# EAGLE design RTx_Charger (EAGLE 6.5.0)
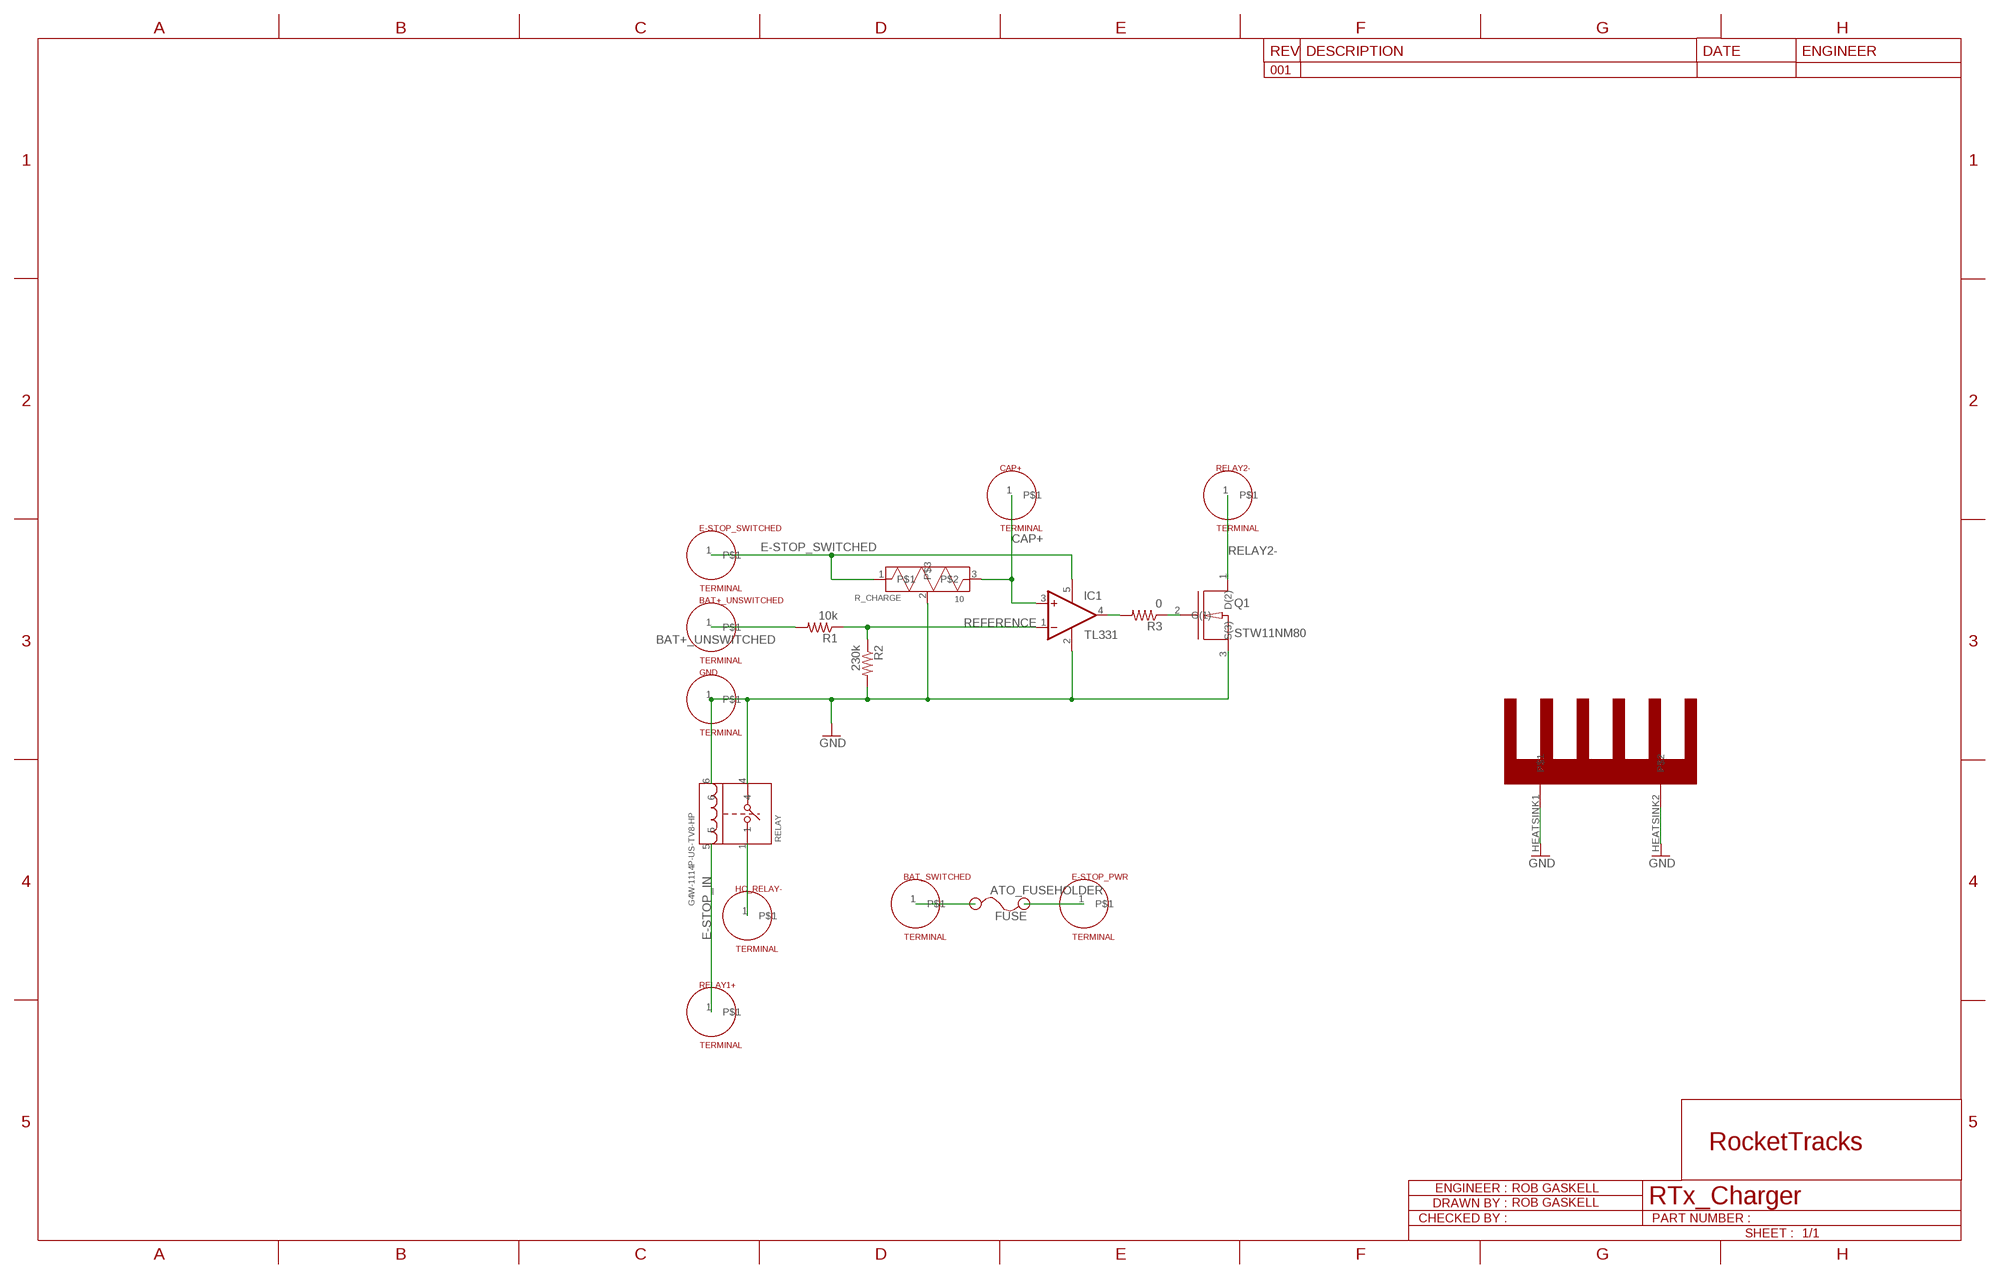
[diagram p0: schematic, sheet 1]

## Parts
BAT+_UNSWITCHED  TERMINAL  TERMINALSTUD  [TERMINAL_STUD]
BAT_SWITCHED  TERMINAL  TERMINALNO_STUD  [TERMINAL_NO-STUD]
CAP+  TERMINAL  TERMINALSTUD  [TERMINAL_STUD]
E-STOP_PWR  TERMINAL  TERMINALSTUD  [TERMINAL_STUD]
E-STOP_SWITCHED  TERMINAL  TERMINALNO_STUD  [TERMINAL_NO-STUD]
FUSE  ATO_FUSEHOLDER  FUSEATO_FUSEHOLDER  [ATO_BLADE_FUSE]
GND  TERMINAL  TERMINALSTUD  [TERMINAL_STUD]
HC_RELAY-  TERMINAL  TERMINALNO_STUD  [TERMINAL_NO-STUD]
HEATSINK  WA-T247-101E  [WA-T247-101E]
IC1  TL331  [DBV-R-PDSO-G5]
Q1  STW11NM80  [TO-247]
R1  10k  R-US_R1206  [R1206]
R2  230k  R-US_R1206  [R1206]
R3  0  R-US_R1206  [R1206]
R_CHARGE  10  TEH70  [TEH70]
RELAY  G4W-1114P-US-TV8-HP  [G4W-1114P-US-TV8-HP]
RELAY1+  TERMINAL  TERMINALNO_STUD  [TERMINAL_NO-STUD]
RELAY2-  TERMINAL  TERMINALNO_STUD  [TERMINAL_NO-STUD]

## Nets
BAT+_UNSWITCHED: BAT+_UNSWITCHED.1 R1.2
BAT_SWITCHED: BAT_SWITCHED.1 FUSE.2.1(C) FUSE.2.2(C) FUSE.2.3(C) FUSE.2.4(C)
CAP+: CAP+.1 IC1.3(+IN) R_CHARGE.3
E-STOP_IN: RELAY1+.1 RELAY.5
E-STOP_PWR: E-STOP_PWR.1 FUSE.1.1(A) FUSE.1.2(A) FUSE.1.3(A) FUSE.1.4(A)
E-STOP_SWITCHED: E-STOP_SWITCHED.1 IC1.5(V+) R_CHARGE.1
GND: GND.1 HEATSINK.HEATSINK1 HEATSINK.HEATSINK2 IC1.2(GND) Q1.3(S(3)) R2.2 R_CHARGE.2 RELAY.4 RELAY.6
HC_RELAY-: HC_RELAY-.1 RELAY.1
N$1: IC1.4(OUT) R3.2
N$5: Q1.2(G(1)) R3.1
REFERENCE: IC1.1(-IN) R1.1 R2.1
RELAY2-: Q1.1(D(2)) RELAY2-.1

## Library data of the parts
BAT+_UNSWITCHED BAT_SWITCHED CAP+ E-STOP_PWR E-STOP_SWITCHED GND HC_RELAY- RELAY1+ RELAY2- = temp_library:TERMINAL
FUSE = temp_library:FUSE: FUSE
HEATSINK = temp_library:WA-T247-101E
IC1 = linear:TL331: SINGLE DIFFERENTIAL COMPARATOR Source: Data sheet <http://www.ti.com/lit/ds/symlink/tl331-q1.pdf>
Q1 = temp_library:STW11NM80: N-Channel MOSFET transistor
R1-R3 = motorFeedback:R-US_: RESISTOR, American symbol
R_CHARGE = temp_library:TEH70
RELAY = temp_library:G4W-1114P-US-TV8-HP

## Board
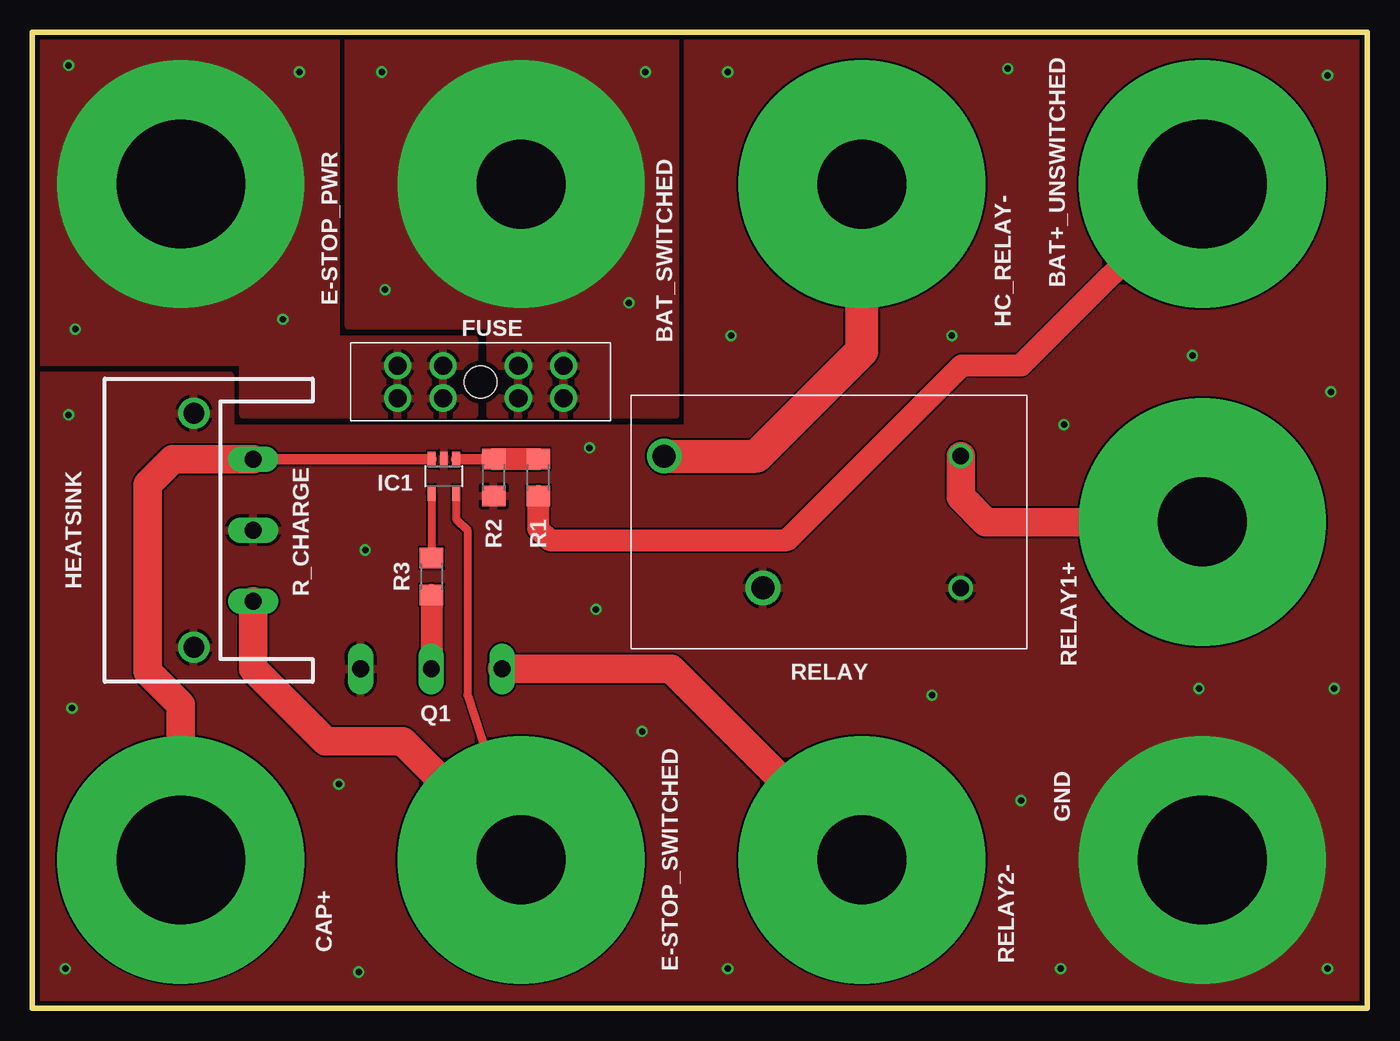
[diagram p1: board, top side]
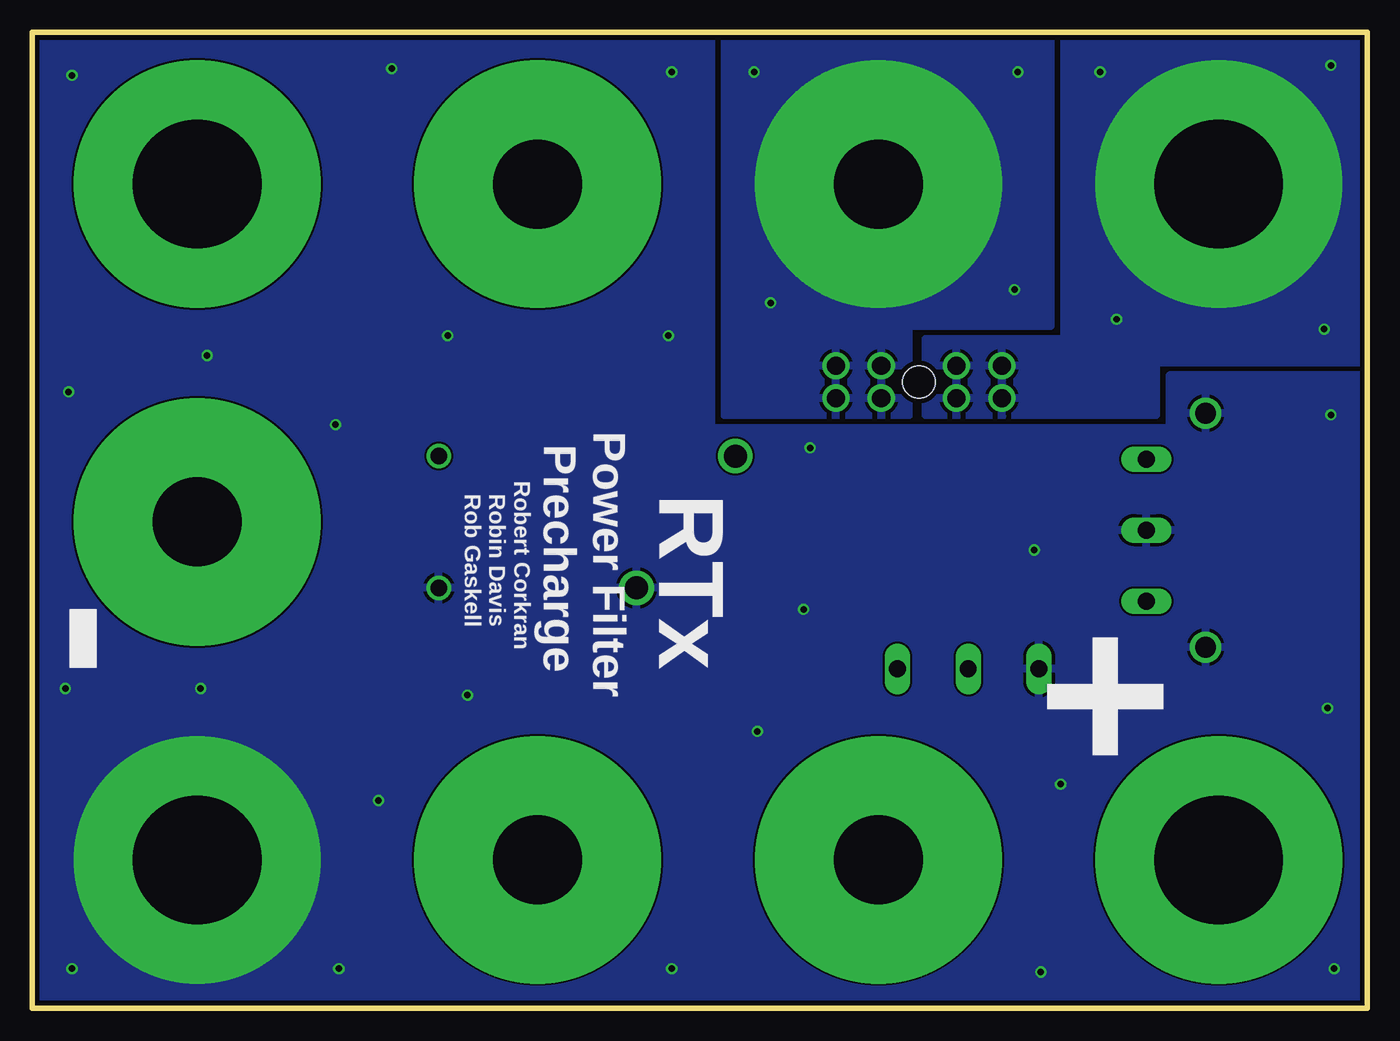
[diagram p2: board, bottom side, seen from below]

Size 102.87 x 75.18 mm. Coordinates in mm from the lower left corner, seen from the top.
Outline: 0,0 102.87,0 102.87,75.18 0,75.18 0,0
Copper layers (1*16): Top 0.0356mm / dielectric 1.5011mm / Bottom 0.0356mm
Design rules "osh-park-2layer *": minimum track width 6mil, minimum drill 13mil, track to track 6mil, track to pad 6mil, pad to pad 6mil, via to via 6mil, smd to smd 6mil, copper to edge 15mil, drill to drill 6mil, minimum pad ring 7mil, minimum via ring 7mil, stop-mask expansion 3mil, vias tented up to drill 30mil, thermal gap 10mil

### Footprints (pad centres in the part's own frame; a part is rotated, then mirrored left to right if it is on the bottom)
TERMINAL_STUD = drill 9.906 pad 19.05: 1 0,0
TERMINAL_NO-STUD = drill 6.858 pad 19.05: 1 0,0
ATO_BLADE_FUSE = drill 1.4: 1.1 -6.4,1.25; 1.2 -6.4,-1.25; 1.3 -2.9,1.25; 1.4 -2.9,-1.25; 2.1 2.9,1.25; 2.2 2.9,-1.25; 2.3 6.4,1.25; 2.4 6.4,-1.25 | hole 2.5: 0,0
WA-T247-101E = drill 1.6: HEATSINK1 -9.017,0; HEATSINK2 9.017,0
DBV-R-PDSO-G5 = smd 0.6 x 1.2: 1 -0.95,-1.306; 2 0,-1.306; 3 0.95,-1.306; 4 0.95,1.306; 5 -0.95,1.306
TO-247 = drill 1.3 long: 1 -5.461,0; 2 0,0; 3 5.461,0
R1206 = smd 1.6 x 1.803: 1 -1.422,0; 2 1.422,0
TEH70 = drill 1.3 long: 1 -5.461,-4.572; 2 0,-4.572; 3 5.461,-4.572
G4W-1114P-US-TV8-HP = drill 1.778: 1 15.24,-5.08; 4 7.62,5.08 | drill 1.27: 5 -7.62,-5.08; 6 -7.62,5.08

### Placement (x,y rotation side)
BAT+_UNSWITCHED  90.17,63.5 0 top
BAT_SWITCHED  37.67,63.5 0 top
CAP+  11.43,11.43 0 top
E-STOP_PWR  11.43,63.5 0 top
E-STOP_SWITCHED  37.67,11.43 0 top
FUSE  34.54,48.26 0 top
GND  90.17,11.43 0 top
HC_RELAY-  63.93,63.5 0 top
HEATSINK  12.45,36.83 90 top
IC1  31.71,40.99 180 top
Q1  30.75,26.14 180 top
R1  38.99,40.89 270 top
R2  35.56,40.89 270 top
R3  30.75,33.27 90 top
R_CHARGE  12.45,36.83 90 top
RELAY  63.93,37.47 180 top
RELAY1+  90.17,37.47 0 top
RELAY2-  63.93,11.43 0 top

### Tracks (layer width: path | path; a pad name or v marks a point on that pad's centre or on a via)
BAT+_UNSWITCHED
  Top 1.676: R1.2 38.99,36.96 39.88,36.07 58.17,36.07 71.63,49.53 76.2,49.53 BAT+_UNSWITCHED.1
BAT_SWITCHED  (via drill 0.5)
  other vias: 26.92,72.14 27.18,55.37 47.24,72.14 45.97,54.36
  pour Bottom: 35.31,45.72 35.31,52.58 24.38,52.58 24.38,75.18 49.53,75.18 49.53,45.72
  pour Top: 35.31,45.72 35.31,52.58 24.38,52.58 24.38,75.18 49.53,75.18 49.53,45.72
CAP+
  Top 0.813: IC1.3 R_CHARGE.3
  Top 2.184: R_CHARGE.3 10.79,42.29 8.89,40.39 8.89,25.91 11.43,23.37 CAP+.1
E-STOP_IN
  Top 2.184: RELAY.5 71.55,39.41 73.51,37.46 90.16,37.46 RELAY1+.1
E-STOP_PWR  (via drill 0.5)
  other vias: 2.79,72.64 3.3,52.32 19.3,53.09 20.57,72.14
  pour Bottom: 23.37,51.56 34.04,51.56 34.04,45.72 16.26,45.72 16.26,49.78 0,49.78 0,75.18 23.37,75.18
  pour Top: 23.37,51.56 34.04,51.56 34.04,45.72 16.26,45.72 16.26,49.78 0,49.78 0,75.18 23.37,75.18
E-STOP_SWITCHED
  Top 0.61: IC1.5 32.66,37.69 33.53,36.83 33.53,24.13 E-STOP_SWITCHED.1
  Top 2.184: R_CHARGE.1 17.02,26.16 22.61,20.57 28.52,20.57 E-STOP_SWITCHED.1
GND  (via drill 0.5)
  other vias: 2.79,45.72 2.54,3.05 25.15,2.79 3.05,23.11 53.59,3.05 79.25,3.05 99.82,3.05 23.62,17.27 46.99,21.34 76.2,16 69.34,24.13 89.92,24.64 100.33,24.64 100.08,47.5 79.5,44.96 99.82,71.88 75.18,72.39 53.59,72.14 53.85,51.82 70.87,51.82 25.65,35.31 42.93,43.18 43.43,30.73 89.41,50.29
  pour Top: 0,0 0,48.77 15.24,48.77 15.24,44.7 50.55,44.7 50.55,75.18 102.87,75.18 102.87,0
  pour Bottom: 0,0 0,48.77 15.24,48.77 15.24,44.7 50.55,44.7 50.55,75.18 102.87,75.18 102.87,0
HC_RELAY-
  Top 2.54: RELAY.1 55.83,42.55 63.92,50.64 HC_RELAY-.1
N$1
  Top 0.61: IC1.4 30.76,34.7 R3.2
N$5
  Top 1.676: R3.1 Q1.2
REFERENCE
  Top 0.813: IC1.1 35.56,42.29 R2.1
  Top 1.676: R1.1 R2.1
RELAY2-
  Top 2.184: Q1.1 49.22,26.14 RELAY2-.1

### Text on the board
bPlace: Power Filter / Precharge | Robert Corkran / Robin Davis / Rob Gaskell | RTx | + | -